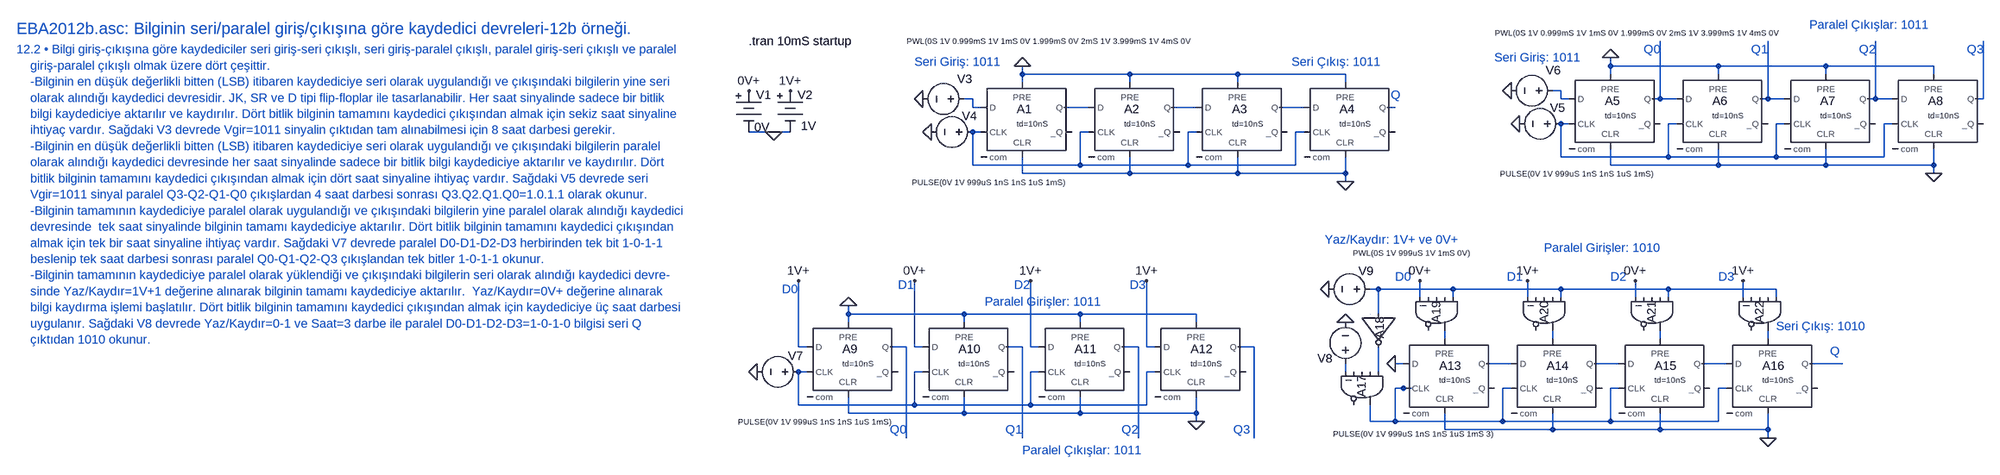
[diagram p0: schematic EBA2012b.asc]
EBA2012b.asc, the LTspice schematic file:
Version 4
SHEET 1 7064 4332
WIRE 3168 128 3168 112
WIRE 3376 128 3168 128
WIRE 3584 128 3376 128
WIRE 3792 128 3584 128
WIRE 2032 144 2032 128
WIRE 2240 144 2032 144
WIRE 2448 144 2240 144
WIRE 2656 144 2448 144
WIRE 3168 144 3168 128
WIRE 3376 144 3376 128
WIRE 3584 144 3584 128
WIRE 3792 144 3792 128
WIRE 2032 160 2032 144
WIRE 2240 160 2240 144
WIRE 2448 160 2448 144
WIRE 2656 160 2656 144
WIRE 3072 176 3056 176
WIRE 1936 192 1920 192
WIRE 3072 192 3072 176
WIRE 3088 192 3072 192
WIRE 3264 192 3264 80
WIRE 3264 192 3248 192
WIRE 3296 192 3264 192
WIRE 3472 192 3472 80
WIRE 3472 192 3456 192
WIRE 3504 192 3472 192
WIRE 3680 192 3680 80
WIRE 3680 192 3664 192
WIRE 3712 192 3680 192
WIRE 3888 192 3888 80
WIRE 3888 192 3872 192
WIRE 1936 208 1936 192
WIRE 1952 208 1936 208
WIRE 2160 208 2112 208
WIRE 2368 208 2320 208
WIRE 2576 208 2528 208
WIRE 2752 208 2736 208
WIRE 3088 240 3072 240
WIRE 3296 240 3280 240
WIRE 3504 240 3488 240
WIRE 3712 240 3696 240
WIRE 1552 256 1504 256
WIRE 1584 256 1552 256
WIRE 1952 256 1936 256
WIRE 2160 256 2144 256
WIRE 2368 256 2352 256
WIRE 2576 256 2560 256
WIRE 3072 304 3072 240
WIRE 3280 304 3280 240
WIRE 3280 304 3072 304
WIRE 3488 304 3488 240
WIRE 3488 304 3280 304
WIRE 3696 304 3696 240
WIRE 3696 304 3488 304
WIRE 1936 320 1936 256
WIRE 2144 320 2144 256
WIRE 2144 320 1936 320
WIRE 2352 320 2352 256
WIRE 2352 320 2144 320
WIRE 2560 320 2560 256
WIRE 2560 320 2352 320
WIRE 3168 320 3168 288
WIRE 3376 320 3376 288
WIRE 3376 320 3168 320
WIRE 3584 320 3584 288
WIRE 3584 320 3376 320
WIRE 3792 320 3792 288
WIRE 3792 320 3584 320
WIRE 2032 336 2032 304
WIRE 2240 336 2240 304
WIRE 2240 336 2032 336
WIRE 2448 336 2448 304
WIRE 2448 336 2240 336
WIRE 2656 336 2656 304
WIRE 2656 336 2448 336
WIRE 3792 336 3792 320
WIRE 2656 352 2656 336
WIRE 2720 560 2704 560
WIRE 2864 560 2720 560
WIRE 3072 560 2864 560
WIRE 3280 560 3072 560
WIRE 3488 560 3280 560
WIRE 2800 576 2800 544
WIRE 2864 576 2864 560
WIRE 3008 576 3008 544
WIRE 3072 576 3072 560
WIRE 3216 576 3216 544
WIRE 3280 576 3280 560
WIRE 3424 576 3424 544
WIRE 3488 576 3488 560
WIRE 1696 608 1696 592
WIRE 1920 608 1696 608
WIRE 2144 608 1920 608
WIRE 2368 608 2144 608
WIRE 2720 608 2720 560
WIRE 1696 624 1696 608
WIRE 1920 624 1920 608
WIRE 2144 624 2144 608
WIRE 2368 624 2368 608
WIRE 2848 656 2848 640
WIRE 3056 656 3056 640
WIRE 3264 656 3264 640
WIRE 3472 656 3472 640
WIRE 1600 672 1600 544
WIRE 1616 672 1600 672
WIRE 1808 672 1776 672
WIRE 1824 672 1824 544
WIRE 1840 672 1824 672
WIRE 2032 672 2000 672
WIRE 2048 672 2048 544
WIRE 2064 672 2048 672
WIRE 2256 672 2224 672
WIRE 2272 672 2272 544
WIRE 2288 672 2272 672
WIRE 2480 672 2448 672
WIRE 2768 704 2752 704
WIRE 2976 704 2928 704
WIRE 3184 704 3136 704
WIRE 3392 704 3344 704
WIRE 3616 704 3552 704
WIRE 1616 720 1600 720
WIRE 1840 720 1824 720
WIRE 2064 720 2048 720
WIRE 2288 720 2272 720
WIRE 2656 720 2656 704
WIRE 2720 720 2720 672
WIRE 2768 752 2752 752
WIRE 2784 752 2768 752
WIRE 2976 752 2960 752
WIRE 3184 752 3168 752
WIRE 3392 752 3376 752
WIRE 1600 784 1600 720
WIRE 1824 784 1824 720
WIRE 1824 784 1600 784
WIRE 2048 784 2048 720
WIRE 2048 784 1824 784
WIRE 2272 784 2272 720
WIRE 2272 784 2048 784
WIRE 1696 800 1696 768
WIRE 1920 800 1920 768
WIRE 1920 800 1696 800
WIRE 2144 800 2144 768
WIRE 2144 800 1920 800
WIRE 2368 800 2368 768
WIRE 2368 800 2144 800
WIRE 2368 816 2368 800
WIRE 2704 816 2704 784
WIRE 2752 816 2752 752
WIRE 2752 816 2704 816
WIRE 2960 816 2960 752
WIRE 2960 816 2752 816
WIRE 3168 816 3168 752
WIRE 3168 816 2960 816
WIRE 3376 816 3376 752
WIRE 3376 816 3168 816
WIRE 2848 832 2848 800
WIRE 3056 832 3056 800
WIRE 3056 832 2848 832
WIRE 3264 832 3264 800
WIRE 3264 832 3056 832
WIRE 3472 832 3472 800
WIRE 3472 832 3264 832
WIRE 1808 848 1808 672
WIRE 2032 848 2032 672
WIRE 2256 848 2256 672
WIRE 2480 848 2480 672
WIRE 3472 848 3472 832
FLAG 1552 256 0
FLAG 1584 176 1V+
FLAG 1504 176 0V+
FLAG 1856 256 0
FLAG 2032 128 0
FLAG 2656 352 0
FLAG 1840 192 0
FLAG 2992 240 0
FLAG 3168 112 0
FLAG 3792 336 0
FLAG 2976 176 0
FLAG 1520 720 0
FLAG 1696 592 0
FLAG 2368 816 0
FLAG 1600 544 1V+
FLAG 1824 544 0V+
FLAG 2048 544 1V+
FLAG 2272 544 1V+
FLAG 2656 624 0
FLAG 3472 848 0
FLAG 2752 704 0
FLAG 3216 544 0V+
FLAG 2800 544 0V+
FLAG 2624 560 0
FLAG 3008 544 1V+
FLAG 3424 544 1V+
SYMBOL Misc\\battery 1584 160 R0
WINDOW 3 21 84 Left 2
WINDOW 0 14 24 Left 2
SYMATTR Value 1V
SYMATTR InstName V2
SYMBOL Misc\\battery 1504 160 R0
WINDOW 3 11 87 Left 2
WINDOW 0 14 24 Left 2
SYMATTR Value 0V
SYMATTR InstName V1
SYMBOL Digital\\dflop 2032 160 R0
WINDOW 0 -11 52 Left 2
WINDOW 3 -11 80 Left 1
SYMATTR InstName A1
SYMATTR Value td=10nS
SYMBOL voltage 1952 256 R90
WINDOW 0 -31 7 VRight 2
WINDOW 3 97 -161 VRight 1
WINDOW 123 0 0 Left 0
WINDOW 39 0 0 Left 0
SYMATTR InstName V4
SYMATTR Value PULSE(0V 1V 999uS 1nS 1nS 1uS 1mS)
SYMBOL Digital\\dflop 2240 160 R0
WINDOW 0 -11 52 Left 2
WINDOW 3 -11 80 Left 1
SYMATTR InstName A2
SYMATTR Value td=10nS
SYMBOL Digital\\dflop 2448 160 R0
WINDOW 0 -11 52 Left 2
WINDOW 3 -11 80 Left 1
SYMATTR InstName A3
SYMATTR Value td=10nS
SYMBOL Digital\\dflop 2656 160 R0
WINDOW 0 -11 52 Left 2
WINDOW 3 -11 80 Left 1
SYMATTR InstName A4
SYMATTR Value td=10nS
SYMBOL voltage 1936 192 R90
WINDOW 0 -39 0 VRight 2
WINDOW 3 -112 -420 VRight 1
WINDOW 123 0 0 Left 0
WINDOW 39 0 0 Left 0
SYMATTR InstName V3
SYMATTR Value PWL(0S 1V 0.999mS 1V 1mS 0V 1.999mS 0V 2mS 1V 3.999mS 1V 4mS 0V
SYMBOL Digital\\dflop 3168 144 R0
WINDOW 0 -11 52 Left 2
WINDOW 3 -11 80 Left 1
SYMATTR InstName A5
SYMATTR Value td=10nS
SYMBOL voltage 3088 240 R90
WINDOW 0 -31 7 VRight 2
WINDOW 3 97 -161 VRight 1
WINDOW 123 0 0 Left 0
WINDOW 39 0 0 Left 0
SYMATTR InstName V5
SYMATTR Value PULSE(0V 1V 999uS 1nS 1nS 1uS 1mS)
SYMBOL Digital\\dflop 3376 144 R0
WINDOW 0 -11 52 Left 2
WINDOW 3 -11 80 Left 1
SYMATTR InstName A6
SYMATTR Value td=10nS
SYMBOL Digital\\dflop 3584 144 R0
WINDOW 0 -11 52 Left 2
WINDOW 3 -11 80 Left 1
SYMATTR InstName A7
SYMATTR Value td=10nS
SYMBOL Digital\\dflop 3792 144 R0
WINDOW 0 -11 52 Left 2
WINDOW 3 -11 80 Left 1
SYMATTR InstName A8
SYMATTR Value td=10nS
SYMBOL voltage 3072 176 R90
WINDOW 0 -39 0 VRight 2
WINDOW 3 -112 -420 VRight 1
WINDOW 123 0 0 Left 0
WINDOW 39 0 0 Left 0
SYMATTR InstName V6
SYMATTR Value PWL(0S 1V 0.999mS 1V 1mS 0V 1.999mS 0V 2mS 1V 3.999mS 1V 4mS 0V
SYMBOL Digital\\dflop 1696 624 R0
WINDOW 0 -11 52 Left 2
WINDOW 3 -11 80 Left 1
SYMATTR InstName A9
SYMATTR Value td=10nS
SYMBOL voltage 1616 720 R90
WINDOW 0 -31 7 VRight 2
WINDOW 3 97 -161 VRight 1
WINDOW 123 0 0 Left 0
WINDOW 39 0 0 Left 0
SYMATTR InstName V7
SYMATTR Value PULSE(0V 1V 999uS 1nS 1nS 1uS 1mS)
SYMBOL Digital\\dflop 1920 624 R0
WINDOW 0 -11 52 Left 2
WINDOW 3 -11 80 Left 1
SYMATTR InstName A10
SYMATTR Value td=10nS
SYMBOL Digital\\dflop 2144 624 R0
WINDOW 0 -11 52 Left 2
WINDOW 3 -11 80 Left 1
SYMATTR InstName A11
SYMATTR Value td=10nS
SYMBOL Digital\\dflop 2368 624 R0
WINDOW 0 -11 52 Left 2
WINDOW 3 -11 80 Left 1
SYMATTR InstName A12
SYMATTR Value td=10nS
SYMBOL Digital\\dflop 2848 656 R0
WINDOW 0 -11 52 Left 2
WINDOW 3 -11 80 Left 1
SYMATTR InstName A13
SYMATTR Value td=10nS
SYMBOL voltage 2656 720 R180
WINDOW 0 54 26 Right 2
WINDOW 3 24 -120 Right 1
WINDOW 123 0 0 Left 0
WINDOW 39 0 0 Left 0
SYMATTR InstName V8
SYMATTR Value PULSE(0V 1V 999uS 1nS 1nS 1uS 1mS 3)
SYMBOL Digital\\dflop 3056 656 R0
WINDOW 0 -11 52 Left 2
WINDOW 3 -11 80 Left 1
SYMATTR InstName A14
SYMATTR Value td=10nS
SYMBOL Digital\\dflop 3264 656 R0
WINDOW 0 -11 52 Left 2
WINDOW 3 -11 80 Left 1
SYMATTR InstName A15
SYMATTR Value td=10nS
SYMBOL Digital\\dflop 3472 656 R0
WINDOW 0 -11 52 Left 2
WINDOW 3 -11 80 Left 1
SYMATTR InstName A16
SYMATTR Value td=10nS
SYMBOL Digital\\and 2752 752 R90
WINDOW 0 -25 64 Left 2
SYMATTR InstName A17
SYMBOL Digital\\inv 2784 608 R90
WINDOW 0 5 61 Left 2
SYMATTR InstName A18
SYMBOL Digital\\and 2896 608 R90
WINDOW 0 -25 64 Left 2
SYMATTR InstName A19
SYMBOL Digital\\and 3104 608 R90
WINDOW 0 -25 64 Left 2
SYMATTR InstName A20
SYMBOL Digital\\and 3312 608 R90
WINDOW 0 -25 64 Left 2
SYMATTR InstName A21
SYMBOL Digital\\and 3520 608 R90
WINDOW 0 -25 64 Left 2
SYMATTR InstName A22
SYMBOL voltage 2720 560 M270
WINDOW 0 35 9 VRight 2
WINDOW 3 70 -176 VRight 1
WINDOW 123 0 0 Left 0
WINDOW 39 0 0 Left 0
SYMATTR InstName V9
SYMATTR Value PWL(0S 1V 999uS 1V 1mS 0V)
TEXT -232 56 Left 3 ;EBA2012b.asc: Bilginin seri/paralel giriş/çıkışına göre kaydedici devreleri-12b örneği.
TEXT -232 96 Left 2 ;12.2 • Bilgi giriş-çıkışına göre kaydediciler seri giriş-seri çıkışlı, seri giriş-paralel çıkışlı, paralel giriş-seri çıkışlı ve paralel \n    giriş-paralel çıkışlı olmak üzere dört çeşittir.\n    -Bilginin en düşük değerlikli bitten (LSB) itibaren kaydediciye seri olarak uygulandığı ve çıkışındaki bilgilerin yine seri \n    olarak alındığı kaydedici devresidir. JK, SR ve D tipi flip-floplar ile tasarlanabilir. Her saat sinyalinde sadece bir bitlik \n    bilgi kaydediciye aktarılır ve kaydırılır. Dört bitlik bilginin tamamını kaydedici çıkışından almak için sekiz saat sinyaline\n    ihtiyaç vardır. Sağdaki V3 devrede Vgir=1011 sinyalin çıktıdan tam alınabilmesi için 8 saat darbesi gerekir.\n    -Bilginin en düşük değerlikli bitten (LSB) itibaren kaydediciye seri olarak uygulandığı ve çıkışındaki bilgilerin paralel \n    olarak alındığı kaydedici devresinde her saat sinyalinde sadece bir bitlik bilgi kaydediciye aktarılır ve kaydırılır. Dört \n    bitlik bilginin tamamını kaydedici çıkışından almak için dört saat sinyaline ihtiyaç vardır. Sağdaki V5 devrede seri \n    Vgir=1011 sinyal paralel Q3-Q2-Q1-Q0 çıkışlardan 4 saat darbesi sonrası Q3.Q2.Q1.Q0=1.0.1.1 olarak okunur.\n    -Bilginin tamamının kaydediciye paralel olarak uygulandığı ve çıkışındaki bilgilerin yine paralel olarak alındığı kaydedici \n    devresinde  tek saat sinyalinde bilginin tamamı kaydediciye aktarılır. Dört bitlik bilginin tamamını kaydedici çıkışından \n    almak için tek bir saat sinyaline ihtiyaç vardır. Sağdaki V7 devrede paralel D0-D1-D2-D3 herbirinden tek bit 1-0-1-1\n    beslenip tek saat darbesi sonrası paralel Q0-Q1-Q2-Q3 çıkışlandan tek bitler 1-0-1-1 okunur.\n    -Bilginin tamamının kaydediciye paralel olarak yüklendiği ve çıkışındaki bilgilerin seri olarak alındığı kaydedici devre-\n    sinde Yaz/Kaydır=1V+1 değerine alınarak bilginin tamamı kaydediciye aktarılır.  Yaz/Kaydır=0V+ değerine alınarak \n    bilgi kaydırma işlemi başlatılır. Dört bitlik bilginin tamamını kaydedici çıkışından almak için kaydediciye üç saat darbesi\n    uygulanır. Sağdaki V8 devrede Yaz/Kaydır=0-1 ve Saat=3 darbe ile paralel D0-D1-D2-D3=1-0-1-0 bilgisi seri Q\n    çıktıdan 1010 okunur.
TEXT 1504 80 Left 2 !.tran 10mS startup
TEXT 1824 120 Left 2 ;Seri Giriş: 1011
TEXT 2552 120 Left 2 ;Seri Çıkış: 1011
TEXT 2744 184 Left 2 ;Q
TEXT 2944 112 Left 2 ;Seri Giriş: 1011
TEXT 3552 48 Left 2 ;Paralel Çıkışlar: 1011
TEXT 3856 96 Left 2 ;Q3
TEXT 3648 96 Left 2 ;Q2
TEXT 3440 96 Left 2 ;Q1
TEXT 3232 96 Left 2 ;Q0
TEXT 1960 584 Left 2 ;Paralel Girişler: 1011
TEXT 2032 872 Left 2 ;Paralel Çıkışlar: 1011
TEXT 2440 832 Left 2 ;Q3
TEXT 2224 832 Left 2 ;Q2
TEXT 2000 832 Left 2 ;Q1
TEXT 1776 832 Left 2 ;Q0
TEXT 1568 560 Left 2 ;D0
TEXT 1792 552 Left 2 ;D1
TEXT 2016 552 Left 2 ;D2
TEXT 2240 552 Left 2 ;D3
TEXT 3488 632 Left 2 ;Seri Çıkış: 1010
TEXT 3592 680 Left 2 ;Q
TEXT 2752 536 Left 2 ;D0
TEXT 2968 536 Left 2 ;D1
TEXT 3168 536 Left 2 ;D2
TEXT 3376 536 Left 2 ;D3
TEXT 3040 480 Left 2 ;Paralel Girişler: 1010
TEXT 2616 464 Left 2 ;Yaz/Kaydır: 1V+ ve 0V+

The netlist it stands for:
* EBA2012b.asc
V2 1V+ 0 1V
V1 0V+ 0 0V
A1 N002 0 N012 0 0 0 N007 0 DFLOP td=10nS
V4 N012 0 PULSE(0V 1V 999uS 1nS 1nS 1uS 1mS)
A2 N007 0 N012 0 0 0 N008 0 DFLOP td=10nS
A3 N008 0 N012 0 0 0 N009 0 DFLOP td=10nS
A4 N009 0 N012 0 0 0 N010 0 DFLOP td=10nS
V3 N002 0 PWL(0S 1V 0.999mS 1V 1mS 0V 1.999mS 0V 2mS 1V 3.999mS 1V 4mS 0V
A5 N001 0 N011 0 0 0 N003 0 DFLOP td=10nS
V5 N011 0 PULSE(0V 1V 999uS 1nS 1nS 1uS 1mS)
A6 N003 0 N011 0 0 0 N004 0 DFLOP td=10nS
A7 N004 0 N011 0 0 0 N005 0 DFLOP td=10nS
A8 N005 0 N011 0 0 0 N006 0 DFLOP td=10nS
V6 N001 0 PWL(0S 1V 0.999mS 1V 1mS 0V 1.999mS 0V 2mS 1V 3.999mS 1V 4mS 0V
A9 1V+ 0 N026 0 0 0 N018 0 DFLOP td=10nS
V7 N026 0 PULSE(0V 1V 999uS 1nS 1nS 1uS 1mS)
A10 0V+ 0 N026 0 0 0 N019 0 DFLOP td=10nS
A11 1V+ 0 N026 0 0 0 N020 0 DFLOP td=10nS
A12 1V+ 0 N026 0 0 0 N021 0 DFLOP td=10nS
A13 0 0 N029 N014 0 0 N022 0 DFLOP td=10nS
V8 N027 0 PULSE(0V 1V 999uS 1nS 1nS 1uS 1mS 3)
A14 N022 0 N029 N015 0 0 N023 0 DFLOP td=10nS
A15 N023 0 N029 N016 0 0 N024 0 DFLOP td=10nS
A16 N024 0 N029 N017 0 0 N025 0 DFLOP td=10nS
A17 N028 0 0 0 N027 0 N029 0 AND
A18 N013 0 0 0 0 N028 0 0 BUF
A19 N013 0 0 0 0V+ 0 N014 0 AND
A20 N013 0 0 0 1V+ 0 N015 0 AND
A21 N013 0 0 0 0V+ 0 N016 0 AND
A22 N013 0 0 0 1V+ 0 N017 0 AND
V9 N013 0 PWL(0S 1V 999uS 1V 1mS 0V)
* EBA2012b.asc: Bilginin seri/paralel giriş/çıkışına göre kaydedici devreleri-12b örneği.
* 12.2 • Bilgi giriş-çıkışına göre kaydediciler seri giriş-seri çıkışlı, seri giriş-paralel çıkışlı, paralel giriş-seri çıkışlı ve paralel
*     giriş-paralel çıkışlı olmak üzere dört çeşittir.
*     -Bilginin en düşük değerlikli bitten (LSB) itibaren kaydediciye seri olarak uygulandığı ve çıkışındaki bilgilerin yine seri
*     olarak alındığı kaydedici devresidir. JK, SR ve D tipi flip-floplar ile tasarlanabilir. Her saat sinyalinde sadece bir bitlik
*     bilgi kaydediciye aktarılır ve kaydırılır. Dört bitlik bilginin tamamını kaydedici çıkışından almak için sekiz saat sinyaline
*     ihtiyaç vardır. Sağdaki V3 devrede Vgir=1011 sinyalin çıktıdan tam alınabilmesi için 8 saat darbesi gerekir.
*     -Bilginin en düşük değerlikli bitten (LSB) itibaren kaydediciye seri olarak uygulandığı ve çıkışındaki bilgilerin paralel
*     olarak alındığı kaydedici devresinde her saat sinyalinde sadece bir bitlik bilgi kaydediciye aktarılır ve kaydırılır. Dört
*     bitlik bilginin tamamını kaydedici çıkışından almak için dört saat sinyaline ihtiyaç vardır. Sağdaki V5 devrede seri
*     Vgir=1011 sinyal paralel Q3-Q2-Q1-Q0 çıkışlardan 4 saat darbesi sonrası Q3.Q2.Q1.Q0=1.0.1.1 olarak okunur.
*     -Bilginin tamamının kaydediciye paralel olarak uygulandığı ve çıkışındaki bilgilerin yine paralel olarak alındığı kaydedici
*     devresinde  tek saat sinyalinde bilginin tamamı kaydediciye aktarılır. Dört bitlik bilginin tamamını kaydedici çıkışından
*     almak için tek bir saat sinyaline ihtiyaç vardır. Sağdaki V7 devrede paralel D0-D1-D2-D3 herbirinden tek bit 1-0-1-1
*     beslenip tek saat darbesi sonrası paralel Q0-Q1-Q2-Q3 çıkışlandan tek bitler 1-0-1-1 okunur.
*     -Bilginin tamamının kaydediciye paralel olarak yüklendiği ve çıkışındaki bilgilerin seri olarak alındığı kaydedici devre-
*     sinde Yaz/Kaydır=1V+1 değerine alınarak bilginin tamamı kaydediciye aktarılır.  Yaz/Kaydır=0V+ değerine alınarak
*     bilgi kaydırma işlemi başlatılır. Dört bitlik bilginin tamamını kaydedici çıkışından almak için kaydediciye üç saat darbesi
*     uygulanır. Sağdaki V8 devrede Yaz/Kaydır=0-1 ve Saat=3 darbe ile paralel D0-D1-D2-D3=1-0-1-0 bilgisi seri Q
*     çıktıdan 1010 okunur.
.tran 10mS startup
* Seri Giriş: 1011
* Seri Çıkış: 1011
* Q
* Seri Giriş: 1011
* Paralel Çıkışlar: 1011
* Q3
* Q2
* Q1
* Q0
* Paralel Girişler: 1011
* Paralel Çıkışlar: 1011
* Q3
* Q2
* Q1
* Q0
* D0
* D1
* D2
* D3
* Seri Çıkış: 1010
* Q
* D0
* D1
* D2
* D3
* Paralel Girişler: 1010
* Yaz/Kaydır: 1V+ ve 0V+
.backanno
.end